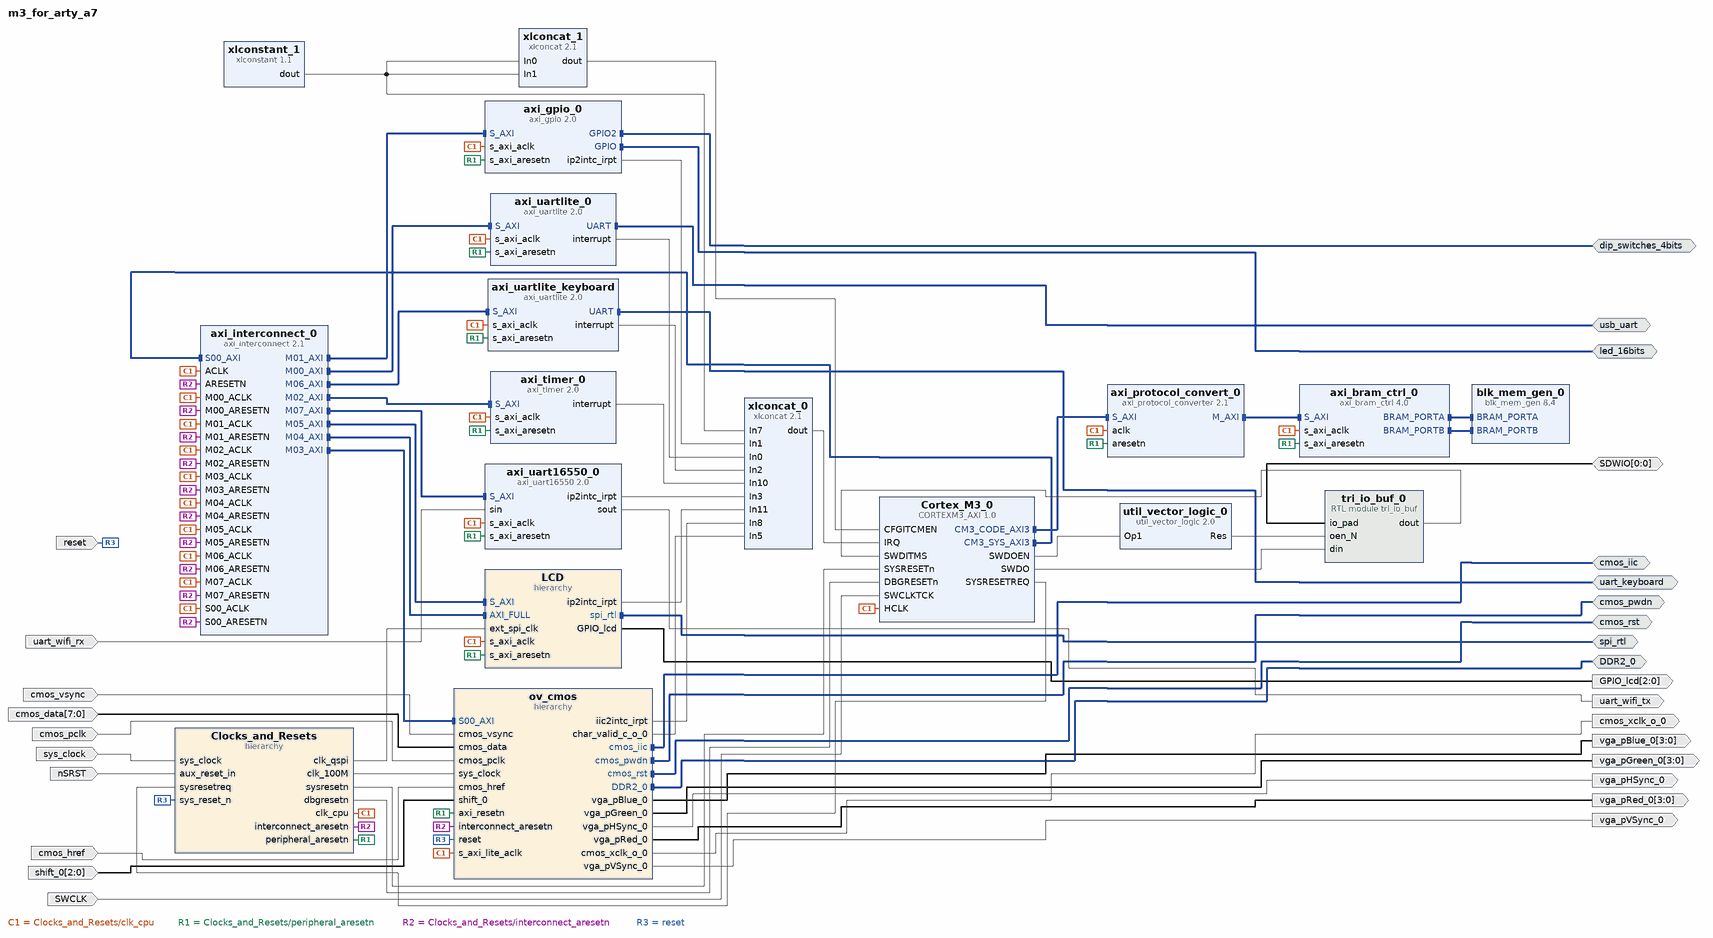
[diagram p0: block diagram of the top level]
# Vivado block design m3_for_arty_a7, xc7a100tcsg324-1, Vivado 2018.2
create_bd_design m3_for_arty_a7

create_bd_intf_port -mode Master -vlnv xilinx.com:interface:gpio_rtl:1.0 dip_switches_4bits
create_bd_intf_port -mode Master -vlnv xilinx.com:interface:uart_rtl:1.0 usb_uart
create_bd_intf_port -mode Master -vlnv xilinx.com:interface:iic_rtl:1.0 cmos_iic
create_bd_intf_port -mode Master -vlnv xilinx.com:interface:gpio_rtl:1.0 cmos_pwdn
create_bd_intf_port -mode Master -vlnv xilinx.com:interface:gpio_rtl:1.0 cmos_rst
create_bd_intf_port -mode Master -vlnv xilinx.com:interface:ddrx_rtl:1.0 DDR2_0
create_bd_intf_port -mode Master -vlnv xilinx.com:interface:spi_rtl:1.0 spi_rtl
create_bd_intf_port -mode Master -vlnv xilinx.com:interface:uart_rtl:1.0 uart_keyboard
create_bd_intf_port -mode Master -vlnv xilinx.com:interface:gpio_rtl:1.0 led_16bits
create_bd_port -dir I -type clk sys_clock
set_property -dict {CONFIG.FREQ_HZ 100000000 CONFIG.PHASE 0.000} [get_bd_ports sys_clock]
create_bd_port -dir I -type rst reset
set_property -dict {CONFIG.POLARITY ACTIVE_LOW} [get_bd_ports reset]
create_bd_port -dir I cmos_vsync
create_bd_port -dir I -from 7 -to 0 cmos_data
create_bd_port -dir I cmos_pclk
create_bd_port -dir I cmos_href
create_bd_port -dir O -from 3 -to 0 vga_pBlue_0
create_bd_port -dir O -from 3 -to 0 vga_pGreen_0
create_bd_port -dir O vga_pHSync_0
create_bd_port -dir O -from 3 -to 0 vga_pRed_0
create_bd_port -dir O vga_pVSync_0
create_bd_port -dir O cmos_xclk_o_0
create_bd_port -dir I -type clk SWCLK
create_bd_port -dir IO -from 0 -to 0 SDWIO
create_bd_port -dir I -type rst nSRST
create_bd_port -dir O -from 2 -to 0 GPIO_lcd
create_bd_port -dir O uart_wifi_tx
create_bd_port -dir I uart_wifi_rx
create_bd_port -dir I -from 2 -to 0 shift_0

create_bd_cell -type hier Clocks_and_Resets
create_bd_cell -type ip -vlnv Arm.com:CortexM:CORTEXM3_AXI:1.0 Cortex_M3_0
set_property -dict [list \
  CONFIG.JTAG_PRESENT false \
  CONFIG.ITCM_SIZE {"1000"} \
  CONFIG.DTCM_SIZE {"0110"} \
  CONFIG.ITCM_INIT_FILE bram_a7.hex \
  CONFIG.TRACE_LVL 1 \
  CONFIG.DEBUG_LVL 2 \
  CONFIG.WIC_PRESENT false \
] [get_bd_cells Cortex_M3_0]
create_bd_cell -type ip -vlnv xilinx.com:ip:axi_gpio:2.0 axi_gpio_0
set_property -dict [list \
  CONFIG.C_GPIO_WIDTH 16 \
  CONFIG.C_GPIO2_WIDTH 4 \
  CONFIG.C_IS_DUAL 1 \
  CONFIG.C_ALL_INPUTS_2 1 \
  CONFIG.C_INTERRUPT_PRESENT 1 \
  CONFIG.USE_BOARD_FLOW true \
  CONFIG.GPIO_BOARD_INTERFACE Custom \
  CONFIG.GPIO2_BOARD_INTERFACE Custom \
  CONFIG.C_ALL_OUTPUTS 1 \
] [get_bd_cells axi_gpio_0]
create_bd_cell -type ip -vlnv xilinx.com:ip:axi_interconnect:2.1 axi_interconnect_0
set_property -dict [list \
  CONFIG.NUM_SI 1 \
  CONFIG.NUM_MI 8 \
  CONFIG.ENABLE_ADVANCED_OPTIONS 1 \
  CONFIG.SYNCHRONIZATION_STAGES 2 \
  CONFIG.M00_HAS_REGSLICE 0 \
  CONFIG.M01_HAS_REGSLICE 3 \
  CONFIG.M02_HAS_REGSLICE 3 \
  CONFIG.M03_HAS_REGSLICE 3 \
  CONFIG.M04_HAS_REGSLICE 3 \
  CONFIG.M05_HAS_REGSLICE 3 \
  CONFIG.M00_HAS_DATA_FIFO 0 \
  CONFIG.M01_HAS_DATA_FIFO 0 \
  CONFIG.S00_HAS_REGSLICE 3 \
  CONFIG.S01_HAS_REGSLICE 3 \
  CONFIG.S01_HAS_DATA_FIFO 1 \
  CONFIG.M00_SECURE 0 \
  CONFIG.M01_SECURE 0 \
  CONFIG.M02_SECURE 0 \
] [get_bd_cells axi_interconnect_0]
create_bd_cell -type ip -vlnv xilinx.com:ip:xlconcat:2.1 xlconcat_0
set_property -dict {CONFIG.NUM_PORTS 12 CONFIG.dout_width 12} [get_bd_cells xlconcat_0]
create_bd_cell -type ip -vlnv xilinx.com:ip:xlconcat:2.1 xlconcat_1
set_property -dict {CONFIG.NUM_PORTS 2 CONFIG.IN6_WIDTH 25} [get_bd_cells xlconcat_1]
create_bd_cell -type ip -vlnv xilinx.com:ip:xlconstant:1.1 xlconstant_1
set_property -dict {CONFIG.CONST_WIDTH 1 CONFIG.CONST_VAL 1} [get_bd_cells xlconstant_1]
create_bd_cell -type ip -vlnv xilinx.com:ip:axi_timer:2.0 axi_timer_0
create_bd_cell -type hier ov_cmos
create_bd_cell -type ip -vlnv xilinx.com:ip:axi_uartlite:2.0 axi_uartlite_0
set_property -dict [list \
  CONFIG.C_BAUDRATE 115200 \
  CONFIG.C_S_AXI_ACLK_FREQ_HZ 50000000 \
  CONFIG.USE_BOARD_FLOW true \
  CONFIG.UARTLITE_BOARD_INTERFACE Custom \
] [get_bd_cells axi_uartlite_0]
create_bd_cell -type ip -vlnv xilinx.com:ip:blk_mem_gen:8.4 blk_mem_gen_0
set_property -dict [list \
  CONFIG.Memory_Type Dual_Port_ROM \
  CONFIG.Assume_Synchronous_Clk true \
  CONFIG.Enable_B Use_ENB_Pin \
  CONFIG.Use_RSTB_Pin true \
  CONFIG.Port_A_Write_Rate 0 \
  CONFIG.Port_B_Clock 100 \
  CONFIG.Port_B_Write_Rate 0 \
  CONFIG.Port_B_Enable_Rate 100 \
] [get_bd_cells blk_mem_gen_0]
create_bd_cell -type ip -vlnv xilinx.com:ip:axi_bram_ctrl:4.0 axi_bram_ctrl_0
create_bd_cell -type ip -vlnv xilinx.com:ip:axi_protocol_converter:2.1 axi_protocol_convert_0
create_bd_cell -type ip -vlnv xilinx.com:ip:util_vector_logic:2.0 util_vector_logic_0
set_property -dict {CONFIG.C_SIZE 1 CONFIG.C_OPERATION not} [get_bd_cells util_vector_logic_0]
create_bd_cell -type hier LCD
create_bd_cell -type ip -vlnv xilinx.com:ip:axi_uartlite:2.0 axi_uartlite_keyboard
create_bd_cell -type ip -vlnv xilinx.com:ip:axi_uart16550:2.0 axi_uart16550_0
create_bd_cell -type module -reference tri_io_buf tri_io_buf_0

# ---- hierarchy /Clocks_and_Resets ----
current_bd_instance /Clocks_and_Resets
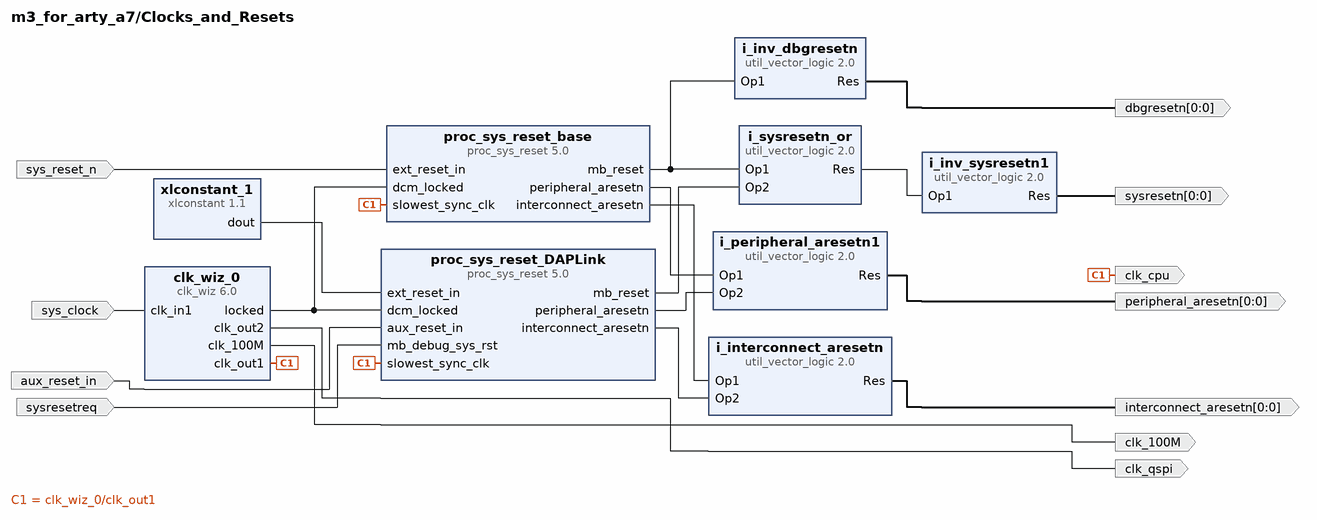
[diagram p1: block diagram inside /Clocks_and_Resets]
create_bd_pin -dir I -type rst aux_reset_in
create_bd_pin -dir O -from 0 -to 0 -type rst interconnect_aresetn
create_bd_pin -dir O -from 0 -to 0 -type rst peripheral_aresetn
create_bd_pin -dir O -type clk clk_cpu
create_bd_pin -dir I -type clk sys_clock
create_bd_pin -dir O -from 0 -to 0 sysresetn
create_bd_pin -dir O -from 0 -to 0 dbgresetn
create_bd_pin -dir O clk_qspi
create_bd_pin -dir I sysresetreq
create_bd_pin -dir I -type rst sys_reset_n
create_bd_pin -dir O -type clk clk_100M

create_bd_cell -type ip -vlnv xilinx.com:ip:clk_wiz:6.0 clk_wiz_0
set_property -dict [list \
  CONFIG.USE_INCLK_SWITCHOVER false \
  CONFIG.SECONDARY_SOURCE Single_ended_clock_capable_pin \
  CONFIG.CLKIN1_JITTER_PS 833.33 \
  CONFIG.CLKIN2_JITTER_PS 833.33 \
  CONFIG.CLKOUT2_USED true \
  CONFIG.CLKOUT3_USED true \
  CONFIG.NUM_OUT_CLKS 3 \
  CONFIG.CLK_OUT3_PORT clk_100M \
  CONFIG.CLKOUT1_REQUESTED_OUT_FREQ 50.0 \
  CONFIG.CLKOUT2_REQUESTED_OUT_FREQ 50.0 \
  CONFIG.CLKOUT3_REQUESTED_OUT_FREQ 100.000 \
  CONFIG.CLKOUT1_DRIVES BUFGCE \
  CONFIG.CLKOUT2_DRIVES BUFGCE \
  CONFIG.CLKOUT3_DRIVES BUFGCE \
  CONFIG.CLKOUT4_DRIVES BUFGCE \
  CONFIG.CLKOUT5_DRIVES BUFGCE \
  CONFIG.CLKOUT6_DRIVES BUFGCE \
  CONFIG.CLKOUT7_DRIVES BUFGCE \
  CONFIG.FEEDBACK_SOURCE FDBK_AUTO \
  CONFIG.USE_RESET false \
  CONFIG.MMCM_DIVCLK_DIVIDE 1 \
  CONFIG.MMCM_CLKFBOUT_MULT_F 10.000 \
  CONFIG.MMCM_CLKIN1_PERIOD 10.000 \
  CONFIG.MMCM_CLKIN2_PERIOD 10.000 \
  CONFIG.MMCM_CLKOUT0_DIVIDE_F 20.000 \
  CONFIG.MMCM_CLKOUT1_DIVIDE 20 \
  CONFIG.MMCM_CLKOUT2_DIVIDE 10 \
  CONFIG.USE_SAFE_CLOCK_STARTUP true \
  CONFIG.USE_BOARD_FLOW true \
  CONFIG.CLK_IN1_BOARD_INTERFACE sys_clock \
  CONFIG.CLK_IN2_BOARD_INTERFACE Custom \
  CONFIG.RESET_BOARD_INTERFACE Custom \
  CONFIG.CLKOUT1_JITTER 151.636 \
  CONFIG.CLKOUT1_PHASE_ERROR 98.575 \
  CONFIG.CLKOUT2_JITTER 151.636 \
  CONFIG.CLKOUT2_PHASE_ERROR 98.575 \
  CONFIG.CLKOUT3_JITTER 130.958 \
  CONFIG.CLKOUT3_PHASE_ERROR 98.575 \
] [get_bd_cells clk_wiz_0]
create_bd_cell -type ip -vlnv xilinx.com:ip:util_vector_logic:2.0 i_interconnect_aresetn
set_property -dict {CONFIG.C_SIZE 1} [get_bd_cells i_interconnect_aresetn]
create_bd_cell -type ip -vlnv xilinx.com:ip:util_vector_logic:2.0 i_inv_dbgresetn
set_property -dict {CONFIG.C_SIZE 1 CONFIG.C_OPERATION not} [get_bd_cells i_inv_dbgresetn]
create_bd_cell -type ip -vlnv xilinx.com:ip:util_vector_logic:2.0 i_inv_sysresetn1
set_property -dict {CONFIG.C_SIZE 1 CONFIG.C_OPERATION not} [get_bd_cells i_inv_sysresetn1]
create_bd_cell -type ip -vlnv xilinx.com:ip:util_vector_logic:2.0 i_peripheral_aresetn1
set_property -dict {CONFIG.C_SIZE 1} [get_bd_cells i_peripheral_aresetn1]
create_bd_cell -type ip -vlnv xilinx.com:ip:util_vector_logic:2.0 i_sysresetn_or
set_property -dict {CONFIG.C_SIZE 1 CONFIG.C_OPERATION or} [get_bd_cells i_sysresetn_or]
create_bd_cell -type ip -vlnv xilinx.com:ip:proc_sys_reset:5.0 proc_sys_reset_DAPLink
set_property -dict [list \
  CONFIG.C_AUX_RST_WIDTH 1 \
  CONFIG.C_EXT_RST_WIDTH 1 \
  CONFIG.USE_BOARD_FLOW true \
  CONFIG.RESET_BOARD_INTERFACE Custom \
] [get_bd_cells proc_sys_reset_DAPLink]
create_bd_cell -type ip -vlnv xilinx.com:ip:proc_sys_reset:5.0 proc_sys_reset_base
set_property -dict [list \
  CONFIG.C_EXT_RESET_HIGH 0 \
  CONFIG.C_AUX_RST_WIDTH 1 \
  CONFIG.C_EXT_RST_WIDTH 1 \
  CONFIG.USE_BOARD_FLOW true \
  CONFIG.RESET_BOARD_INTERFACE reset \
] [get_bd_cells proc_sys_reset_base]
create_bd_cell -type ip -vlnv xilinx.com:ip:xlconstant:1.1 xlconstant_1

# ---- hierarchy /ov_cmos ----
current_bd_instance /ov_cmos
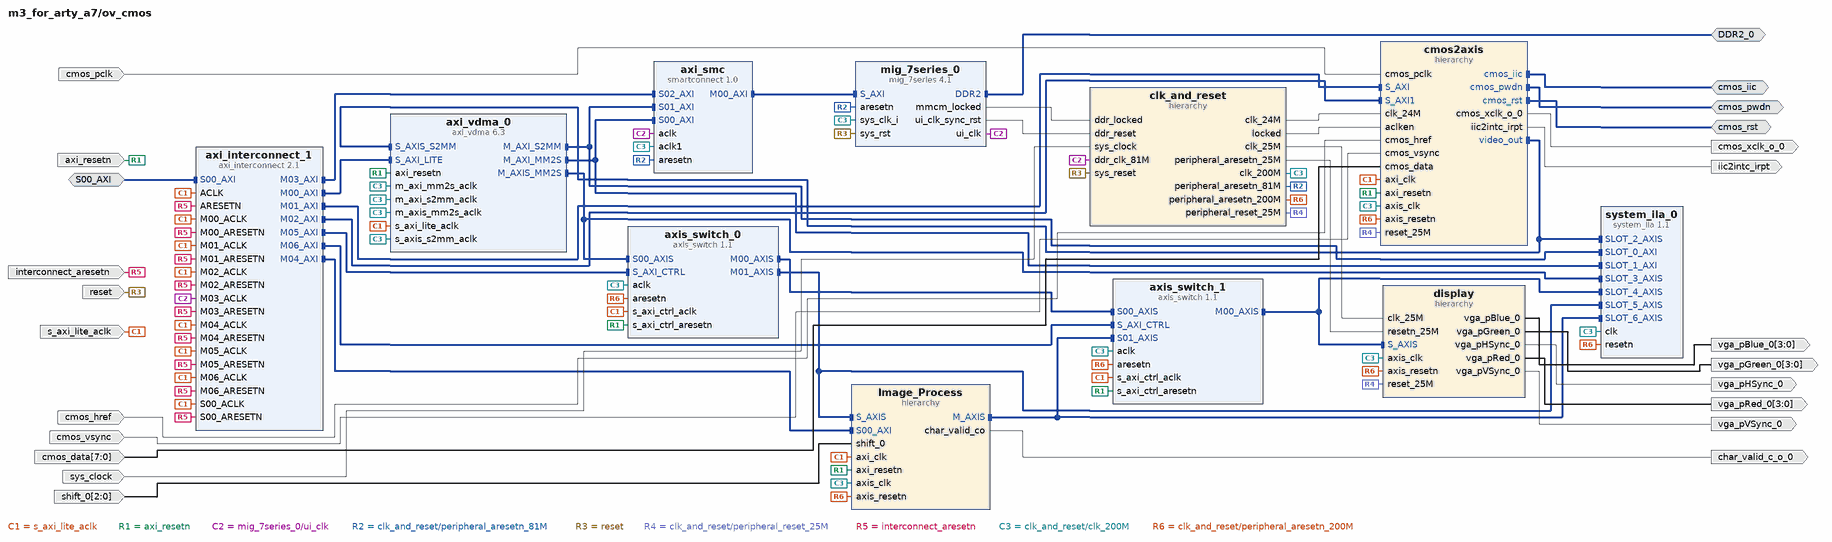
[diagram p2: block diagram inside /ov_cmos]
create_bd_intf_pin -mode Master -vlnv xilinx.com:interface:ddrx_rtl:1.0 DDR2_0
create_bd_intf_pin -mode Master -vlnv xilinx.com:interface:iic_rtl:1.0 cmos_iic
create_bd_intf_pin -mode Master -vlnv xilinx.com:interface:gpio_rtl:1.0 cmos_rst
create_bd_intf_pin -mode Master -vlnv xilinx.com:interface:gpio_rtl:1.0 cmos_pwdn
create_bd_intf_pin -mode Slave -vlnv xilinx.com:interface:aximm_rtl:1.0 S00_AXI
create_bd_pin -dir I cmos_vsync
create_bd_pin -dir I -from 7 -to 0 cmos_data
create_bd_pin -dir I cmos_pclk
create_bd_pin -dir I cmos_href
create_bd_pin -dir I -type clk s_axi_lite_aclk
create_bd_pin -dir I -type rst axi_resetn
create_bd_pin -dir I -type rst reset
create_bd_pin -dir I -type clk sys_clock
create_bd_pin -dir O -from 3 -to 0 vga_pBlue_0
create_bd_pin -dir O -from 3 -to 0 vga_pGreen_0
create_bd_pin -dir O vga_pHSync_0
create_bd_pin -dir O -from 3 -to 0 vga_pRed_0
create_bd_pin -dir O vga_pVSync_0
create_bd_pin -dir O -type intr iic2intc_irpt
create_bd_pin -dir O cmos_xclk_o_0
create_bd_pin -dir I -type rst interconnect_aresetn
create_bd_pin -dir O char_valid_c_o_0
create_bd_pin -dir I -from 2 -to 0 shift_0

create_bd_cell -type ip -vlnv xilinx.com:ip:axi_vdma:6.3 axi_vdma_0
set_property -dict {CONFIG.c_m_axis_mm2s_tdata_width 24} [get_bd_cells axi_vdma_0]
create_bd_cell -type ip -vlnv xilinx.com:ip:mig_7series:4.1 mig_7series_0
set_property -dict {CONFIG.RESET_BOARD_INTERFACE reset} [get_bd_cells mig_7series_0]
create_bd_cell -type ip -vlnv xilinx.com:ip:smartconnect:1.0 axi_smc
set_property -dict {CONFIG.NUM_SI 3 CONFIG.NUM_CLKS 2} [get_bd_cells axi_smc]
create_bd_cell -type hier Image_Process
create_bd_cell -type ip -vlnv xilinx.com:ip:axi_interconnect:2.1 axi_interconnect_1
set_property -dict [list \
  CONFIG.NUM_SI 1 \
  CONFIG.NUM_MI 7 \
  CONFIG.ENABLE_ADVANCED_OPTIONS 1 \
  CONFIG.SYNCHRONIZATION_STAGES 2 \
  CONFIG.M00_HAS_REGSLICE 0 \
  CONFIG.M01_HAS_REGSLICE 3 \
  CONFIG.M02_HAS_REGSLICE 3 \
  CONFIG.M03_HAS_REGSLICE 3 \
  CONFIG.M04_HAS_REGSLICE 3 \
  CONFIG.M05_HAS_REGSLICE 3 \
  CONFIG.M00_HAS_DATA_FIFO 0 \
  CONFIG.M01_HAS_DATA_FIFO 0 \
  CONFIG.S00_HAS_REGSLICE 3 \
  CONFIG.S01_HAS_REGSLICE 3 \
  CONFIG.S01_HAS_DATA_FIFO 1 \
  CONFIG.M00_SECURE 0 \
  CONFIG.M01_SECURE 0 \
  CONFIG.M02_SECURE 0 \
] [get_bd_cells axi_interconnect_1]
create_bd_cell -type hier cmos2axis
create_bd_cell -type hier display
create_bd_cell -type hier clk_and_reset
create_bd_cell -type ip -vlnv xilinx.com:ip:axis_switch:1.1 axis_switch_1
set_property -dict {CONFIG.ROUTING_MODE 1} [get_bd_cells axis_switch_1]
create_bd_cell -type ip -vlnv xilinx.com:ip:axis_switch:1.1 axis_switch_0
set_property -dict {CONFIG.NUM_SI 1 CONFIG.NUM_MI 2 CONFIG.ROUTING_MODE 1 CONFIG.DECODER_REG 1} [get_bd_cells axis_switch_0]
create_bd_cell -type ip -vlnv xilinx.com:ip:system_ila:1.1 system_ila_0
set_property -dict [list \
  CONFIG.C_SLOT_0_APC_EN 0 \
  CONFIG.C_SLOT_1_APC_EN 0 \
  CONFIG.C_SLOT_2_APC_EN 0 \
  CONFIG.C_SLOT_3_APC_EN 0 \
  CONFIG.C_SLOT_4_APC_EN 0 \
  CONFIG.C_SLOT_5_APC_EN 0 \
  CONFIG.C_SLOT_6_APC_EN 0 \
  CONFIG.C_SLOT_0_AXI_AW_SEL_DATA 1 \
  CONFIG.C_SLOT_0_AXI_W_SEL_DATA 1 \
  CONFIG.C_SLOT_0_AXI_B_SEL_DATA 1 \
  CONFIG.C_SLOT_0_AXI_AR_SEL_DATA 1 \
  CONFIG.C_SLOT_0_AXI_R_SEL_DATA 1 \
  CONFIG.C_SLOT_1_AXI_AW_SEL_DATA 1 \
  CONFIG.C_SLOT_1_AXI_W_SEL_DATA 1 \
  CONFIG.C_SLOT_1_AXI_B_SEL_DATA 1 \
  CONFIG.C_SLOT_1_AXI_AR_SEL_DATA 1 \
  CONFIG.C_SLOT_1_AXI_R_SEL_DATA 1 \
  CONFIG.C_SLOT_0_AXI_AW_SEL_TRIG 1 \
  CONFIG.C_SLOT_0_AXI_W_SEL_TRIG 1 \
  CONFIG.C_SLOT_0_AXI_B_SEL_TRIG 1 \
  CONFIG.C_SLOT_0_AXI_AR_SEL_TRIG 1 \
  CONFIG.C_SLOT_0_AXI_R_SEL_TRIG 1 \
  CONFIG.C_SLOT_1_AXI_AW_SEL_TRIG 1 \
  CONFIG.C_SLOT_1_AXI_W_SEL_TRIG 1 \
  CONFIG.C_SLOT_1_AXI_B_SEL_TRIG 1 \
  CONFIG.C_SLOT_1_AXI_AR_SEL_TRIG 1 \
  CONFIG.C_SLOT_1_AXI_R_SEL_TRIG 1 \
  CONFIG.C_SLOT_2_AXI_DATA_SEL 1 \
  CONFIG.C_SLOT_3_AXI_DATA_SEL 1 \
  CONFIG.C_SLOT_4_AXI_DATA_SEL 1 \
  CONFIG.C_SLOT_5_AXI_DATA_SEL 1 \
  CONFIG.C_SLOT_6_AXI_DATA_SEL 1 \
  CONFIG.C_SLOT_2_AXI_TRIG_SEL 1 \
  CONFIG.C_SLOT_3_AXI_TRIG_SEL 1 \
  CONFIG.C_SLOT_4_AXI_TRIG_SEL 1 \
  CONFIG.C_SLOT_5_AXI_TRIG_SEL 1 \
  CONFIG.C_SLOT_6_AXI_TRIG_SEL 1 \
  CONFIG.C_NUM_MONITOR_SLOTS 7 \
  CONFIG.C_SLOT_0_INTF_TYPE xilinx.com:interface:aximm_rtl:1.0 \
  CONFIG.C_SLOT_1_INTF_TYPE xilinx.com:interface:aximm_rtl:1.0 \
  CONFIG.C_SLOT_2_INTF_TYPE xilinx.com:interface:axis_rtl:1.0 \
  CONFIG.C_SLOT_3_INTF_TYPE xilinx.com:interface:axis_rtl:1.0 \
  CONFIG.C_SLOT_4_INTF_TYPE xilinx.com:interface:axis_rtl:1.0 \
  CONFIG.C_SLOT_5_INTF_TYPE xilinx.com:interface:axis_rtl:1.0 \
  CONFIG.C_SLOT_6_INTF_TYPE xilinx.com:interface:axis_rtl:1.0 \
  CONFIG.C_MON_TYPE INTERFACE \
] [get_bd_cells system_ila_0]

# ---- hierarchy /ov_cmos/Image_Process ----
current_bd_instance /ov_cmos/Image_Process
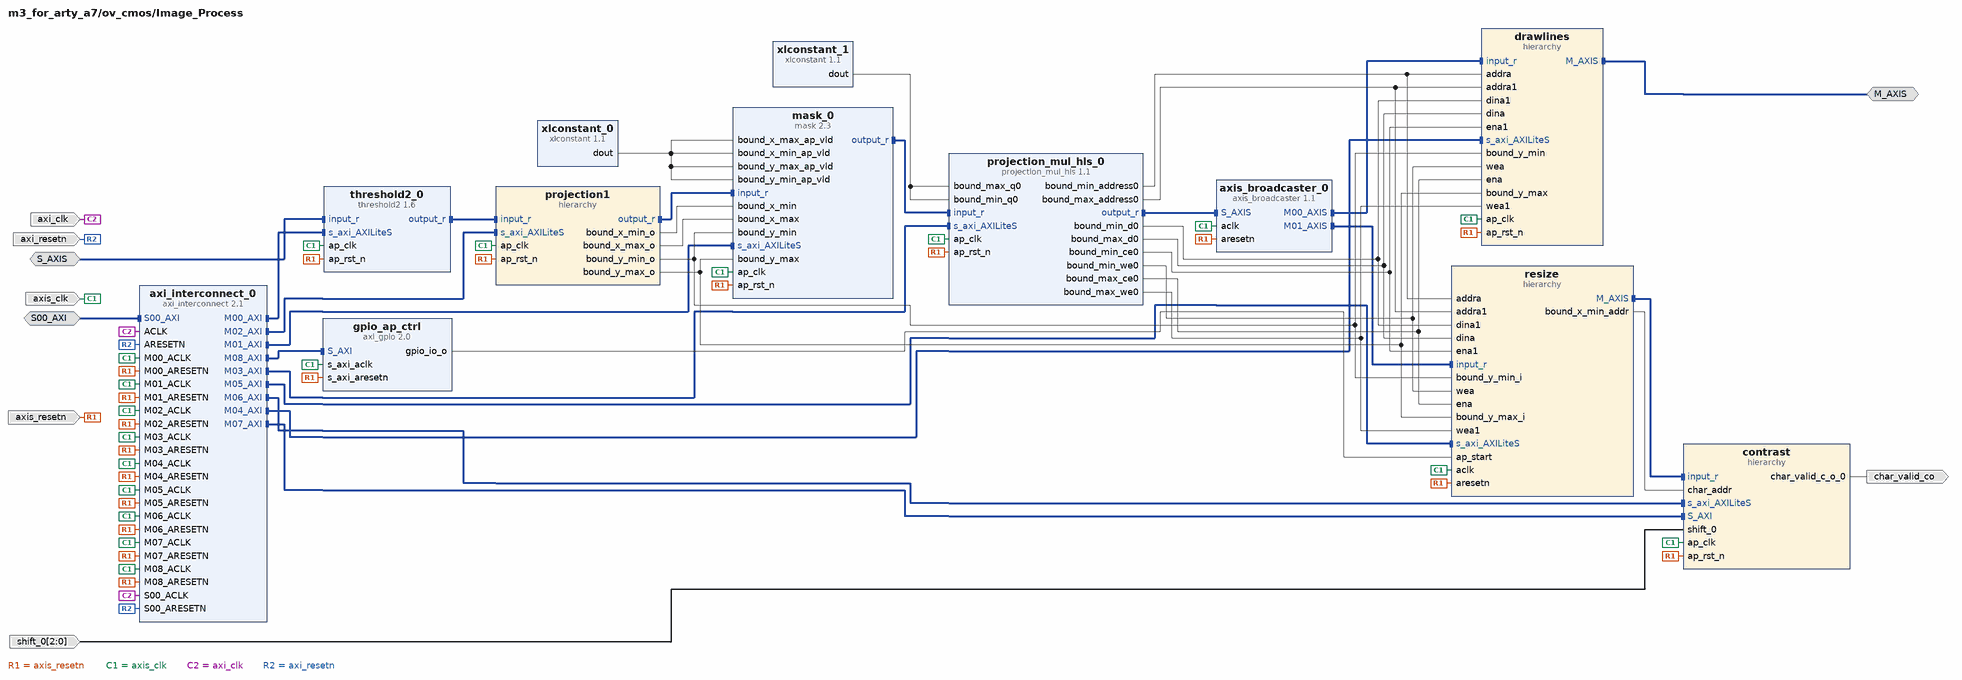
[diagram p3: block diagram inside /ov_cmos/Image_Process]
create_bd_intf_pin -mode Slave -vlnv xilinx.com:interface:aximm_rtl:1.0 S00_AXI
create_bd_intf_pin -mode Slave -vlnv xilinx.com:interface:axis_rtl:1.0 S_AXIS
create_bd_intf_pin -mode Master -vlnv xilinx.com:interface:axis_rtl:1.0 M_AXIS
create_bd_pin -dir I -type clk axi_clk
create_bd_pin -dir I -type rst axi_resetn
create_bd_pin -dir I -type clk axis_clk
create_bd_pin -dir I -type rst axis_resetn
create_bd_pin -dir O char_valid_co
create_bd_pin -dir I -from 2 -to 0 shift_0

create_bd_cell -type ip -vlnv xilinx.com:ip:axi_interconnect:2.1 axi_interconnect_0
set_property -dict {CONFIG.NUM_MI 9} [get_bd_cells axi_interconnect_0]
create_bd_cell -type ip -vlnv xilinx.com:ip:xlconstant:1.1 xlconstant_0
create_bd_cell -type ip -vlnv xilinx.com:ip:axis_broadcaster:1.1 axis_broadcaster_0
create_bd_cell -type ip -vlnv xilinx.com:ip:xlconstant:1.1 xlconstant_1
set_property -dict {CONFIG.CONST_WIDTH 16 CONFIG.CONST_VAL 0} [get_bd_cells xlconstant_1]
create_bd_cell -type hier contrast
create_bd_cell -type hier resize
create_bd_cell -type hier projection1
create_bd_cell -type hier drawlines
create_bd_cell -type ip -vlnv starrynightzyq.com:hls:mask:2.3 mask_0
create_bd_cell -type ip -vlnv starrynightzyq.com:hls:threshold2:1.6 threshold2_0
create_bd_cell -type ip -vlnv starrynightzyq.com:hls:projection_mul_hls:1.1 projection_mul_hls_0
create_bd_cell -type ip -vlnv xilinx.com:ip:axi_gpio:2.0 gpio_ap_ctrl
set_property -dict {CONFIG.C_GPIO_WIDTH 1 CONFIG.C_ALL_OUTPUTS 1} [get_bd_cells gpio_ap_ctrl]

# ---- hierarchy /ov_cmos/Image_Process/contrast ----
current_bd_instance /ov_cmos/Image_Process/contrast
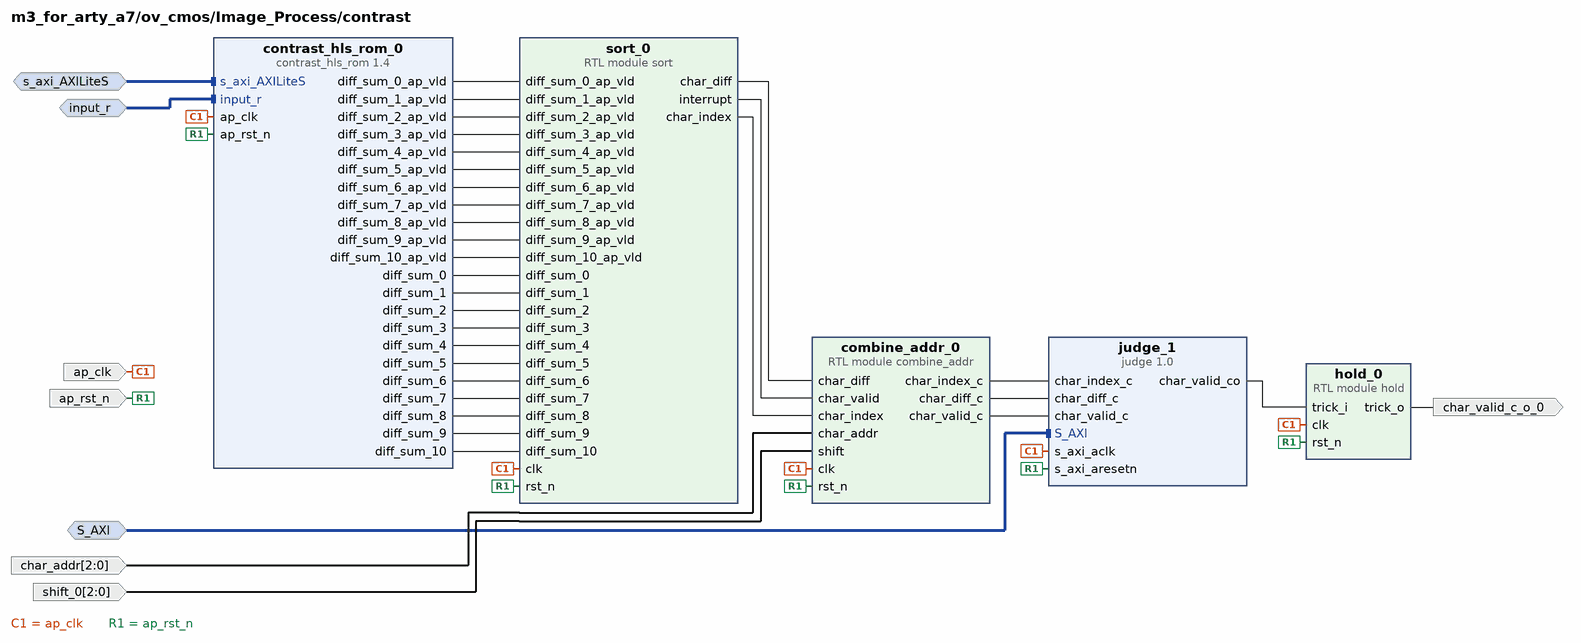
[diagram p4: block diagram inside /ov_cmos/Image_Process/contrast]
create_bd_intf_pin -mode Slave -vlnv xilinx.com:interface:aximm_rtl:1.0 s_axi_AXILiteS
create_bd_intf_pin -mode Slave -vlnv xilinx.com:interface:axis_rtl:1.0 input_r
create_bd_intf_pin -mode Slave -vlnv xilinx.com:interface:aximm_rtl:1.0 S_AXI
create_bd_pin -dir I -type clk ap_clk
create_bd_pin -dir I -type rst ap_rst_n
create_bd_pin -dir I -from 2 -to 0 char_addr
create_bd_pin -dir O char_valid_c_o_0
create_bd_pin -dir I -from 2 -to 0 shift_0

create_bd_cell -type module -reference sort sort_0
create_bd_cell -type module -reference hold hold_0
create_bd_cell -type ip -vlnv starrynightzyq.com:hls:contrast_hls_rom:1.4 contrast_hls_rom_0
create_bd_cell -type ip -vlnv starrynightzyq.com:user:judge:1.0 judge_1
create_bd_cell -type module -reference combine_addr combine_addr_0

# ---- hierarchy /ov_cmos/Image_Process/resize ----
current_bd_instance /ov_cmos/Image_Process/resize
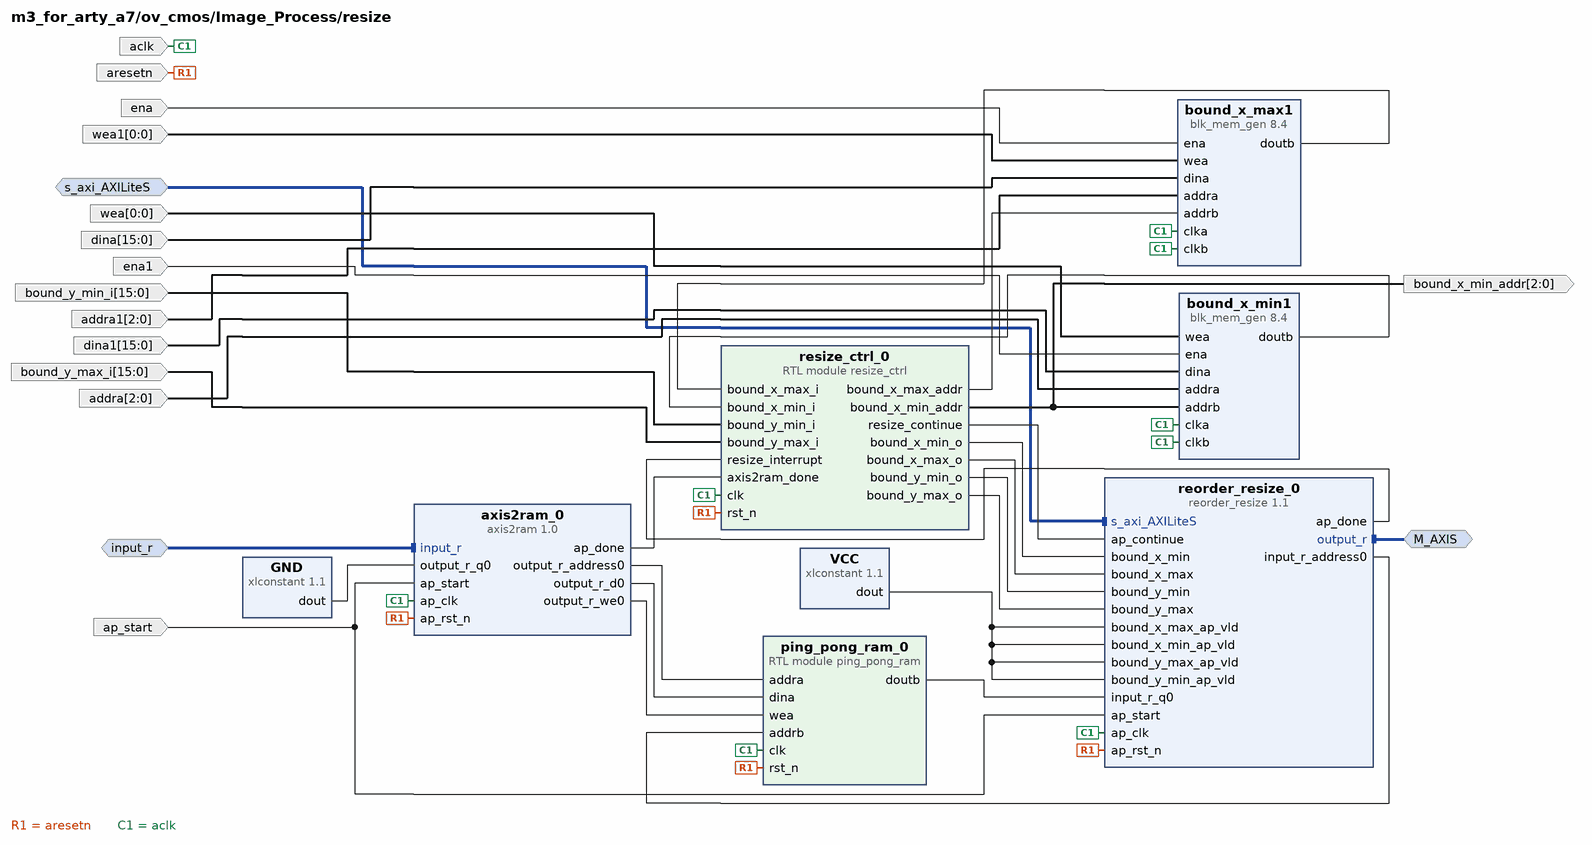
[diagram p5: block diagram inside /ov_cmos/Image_Process/resize]
create_bd_intf_pin -mode Slave -vlnv xilinx.com:interface:axis_rtl:1.0 input_r
create_bd_intf_pin -mode Master -vlnv xilinx.com:interface:axis_rtl:1.0 M_AXIS
create_bd_intf_pin -mode Slave -vlnv xilinx.com:interface:aximm_rtl:1.0 s_axi_AXILiteS
create_bd_pin -dir I -type rst aresetn
create_bd_pin -dir I -type clk aclk
create_bd_pin -dir O -from 2 -to 0 bound_x_min_addr
create_bd_pin -dir I -from 15 -to 0 bound_y_min_i
create_bd_pin -dir I -from 15 -to 0 bound_y_max_i
create_bd_pin -dir I ena
create_bd_pin -dir I -from 0 -to 0 wea
create_bd_pin -dir I ena1
create_bd_pin -dir I -from 0 -to 0 wea1
create_bd_pin -dir I -from 15 -to 0 dina
create_bd_pin -dir I -from 15 -to 0 dina1
create_bd_pin -dir I -from 2 -to 0 addra
create_bd_pin -dir I -from 2 -to 0 addra1
create_bd_pin -dir I ap_start

create_bd_cell -type ip -vlnv xilinx.com:ip:xlconstant:1.1 VCC
create_bd_cell -type ip -vlnv xilinx.com:ip:blk_mem_gen:8.4 bound_x_max1
set_property -dict [list \
  CONFIG.Memory_Type Simple_Dual_Port_RAM \
  CONFIG.Enable_32bit_Address false \
  CONFIG.Use_Byte_Write_Enable false \
  CONFIG.Assume_Synchronous_Clk true \
  CONFIG.Write_Width_A 16 \
  CONFIG.Write_Depth_A 8 \
  CONFIG.Operating_Mode_A NO_CHANGE \
  CONFIG.Write_Width_B 16 \
  CONFIG.Read_Width_B 16 \
  CONFIG.Enable_B Always_Enabled \
  CONFIG.Register_PortB_Output_of_Memory_Primitives true \
  CONFIG.Port_B_Clock 100 \
  CONFIG.Port_B_Enable_Rate 100 \
  CONFIG.use_bram_block Stand_Alone \
] [get_bd_cells bound_x_max1]
create_bd_cell -type ip -vlnv xilinx.com:ip:blk_mem_gen:8.4 bound_x_min1
set_property -dict [list \
  CONFIG.Memory_Type Simple_Dual_Port_RAM \
  CONFIG.Enable_32bit_Address false \
  CONFIG.Use_Byte_Write_Enable false \
  CONFIG.Assume_Synchronous_Clk true \
  CONFIG.Write_Width_A 16 \
  CONFIG.Write_Depth_A 8 \
  CONFIG.Operating_Mode_A NO_CHANGE \
  CONFIG.Write_Width_B 16 \
  CONFIG.Read_Width_B 16 \
  CONFIG.Enable_B Always_Enabled \
  CONFIG.Register_PortB_Output_of_Memory_Primitives true \
  CONFIG.Port_B_Clock 100 \
  CONFIG.Port_B_Enable_Rate 100 \
  CONFIG.use_bram_block Stand_Alone \
] [get_bd_cells bound_x_min1]
create_bd_cell -type ip -vlnv reorder_resize:hls:reorder_resize:1.1 reorder_resize_0
create_bd_cell -type ip -vlnv axis2ram:hls:axis2ram:1.0 axis2ram_0
create_bd_cell -type module -reference resize_ctrl resize_ctrl_0
create_bd_cell -type module -reference ping_pong_ram ping_pong_ram_0
create_bd_cell -type ip -vlnv xilinx.com:ip:xlconstant:1.1 GND
set_property -dict {CONFIG.CONST_VAL 0} [get_bd_cells GND]

# ---- hierarchy /ov_cmos/Image_Process/projection1 ----
current_bd_instance /ov_cmos/Image_Process/projection1
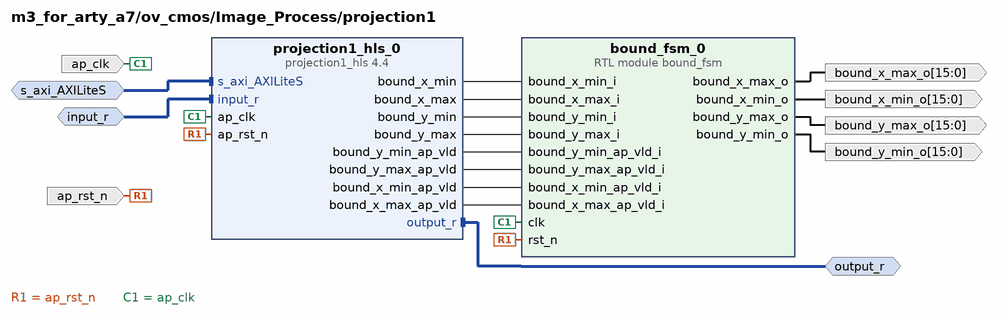
[diagram p6: block diagram inside /ov_cmos/Image_Process/projection1]
create_bd_intf_pin -mode Slave -vlnv xilinx.com:interface:aximm_rtl:1.0 s_axi_AXILiteS
create_bd_intf_pin -mode Master -vlnv xilinx.com:interface:axis_rtl:1.0 output_r
create_bd_intf_pin -mode Slave -vlnv xilinx.com:interface:axis_rtl:1.0 input_r
create_bd_pin -dir I -type rst ap_rst_n
create_bd_pin -dir I -type clk ap_clk
create_bd_pin -dir O -from 15 -to 0 bound_x_min_o
create_bd_pin -dir O -from 15 -to 0 bound_x_max_o
create_bd_pin -dir O -from 15 -to 0 bound_y_max_o
create_bd_pin -dir O -from 15 -to 0 bound_y_min_o

create_bd_cell -type module -reference bound_fsm bound_fsm_0
create_bd_cell -type ip -vlnv starrynightzyq.com:hls:projection1_hls:4.4 projection1_hls_0

# ---- hierarchy /ov_cmos/Image_Process/drawlines ----
current_bd_instance /ov_cmos/Image_Process/drawlines
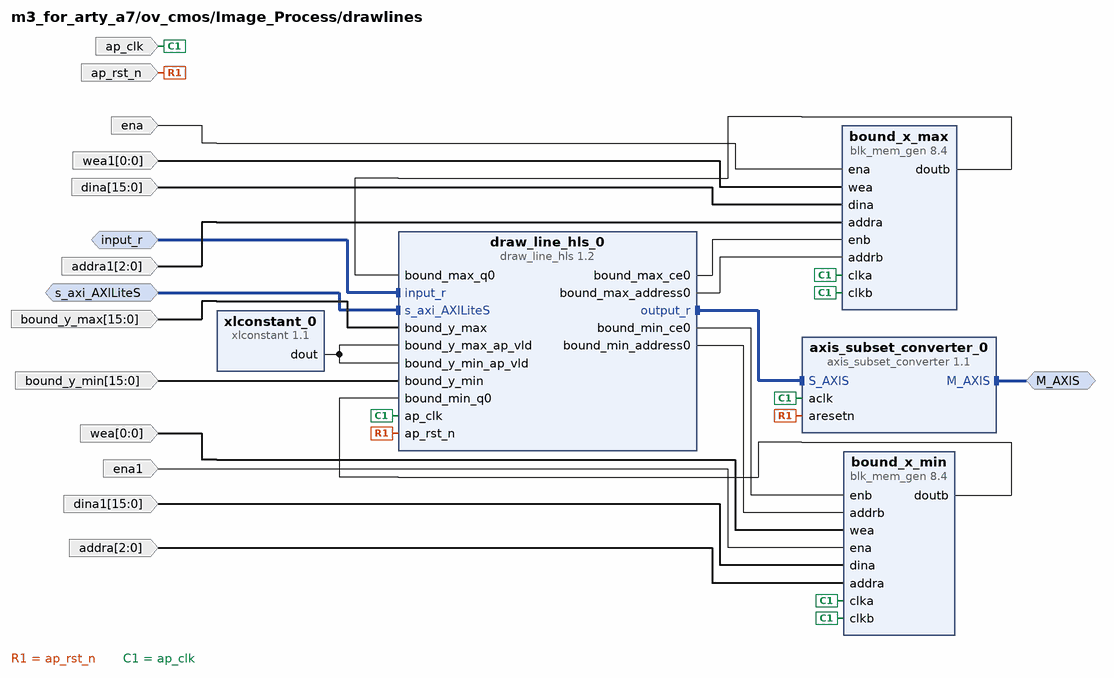
[diagram p7: block diagram inside /ov_cmos/Image_Process/drawlines]
create_bd_intf_pin -mode Slave -vlnv xilinx.com:interface:axis_rtl:1.0 input_r
create_bd_intf_pin -mode Slave -vlnv xilinx.com:interface:aximm_rtl:1.0 s_axi_AXILiteS
create_bd_intf_pin -mode Master -vlnv xilinx.com:interface:axis_rtl:1.0 M_AXIS
create_bd_pin -dir I -type rst ap_rst_n
create_bd_pin -dir I -type clk ap_clk
create_bd_pin -dir I -from 15 -to 0 -type data bound_y_max
create_bd_pin -dir I -from 15 -to 0 -type data bound_y_min
create_bd_pin -dir I ena
create_bd_pin -dir I -from 0 -to 0 wea
create_bd_pin -dir I ena1
create_bd_pin -dir I -from 0 -to 0 wea1
create_bd_pin -dir I -from 15 -to 0 dina
create_bd_pin -dir I -from 15 -to 0 dina1
create_bd_pin -dir I -from 2 -to 0 addra
create_bd_pin -dir I -from 2 -to 0 addra1

create_bd_cell -type ip -vlnv xilinx.com:ip:blk_mem_gen:8.4 bound_x_min
set_property -dict [list \
  CONFIG.Memory_Type Simple_Dual_Port_RAM \
  CONFIG.Enable_32bit_Address false \
  CONFIG.Use_Byte_Write_Enable false \
  CONFIG.Assume_Synchronous_Clk true \
  CONFIG.Write_Width_A 16 \
  CONFIG.Write_Depth_A 8 \
  CONFIG.Operating_Mode_A NO_CHANGE \
  CONFIG.Write_Width_B 16 \
  CONFIG.Read_Width_B 16 \
  CONFIG.Enable_B Use_ENB_Pin \
  CONFIG.Register_PortB_Output_of_Memory_Primitives true \
  CONFIG.Port_B_Clock 100 \
  CONFIG.Port_B_Enable_Rate 100 \
  CONFIG.use_bram_block Stand_Alone \
] [get_bd_cells bound_x_min]
create_bd_cell -type ip -vlnv xilinx.com:ip:blk_mem_gen:8.4 bound_x_max
set_property -dict [list \
  CONFIG.Memory_Type Simple_Dual_Port_RAM \
  CONFIG.Enable_32bit_Address false \
  CONFIG.Use_Byte_Write_Enable false \
  CONFIG.Assume_Synchronous_Clk true \
  CONFIG.Write_Width_A 16 \
  CONFIG.Write_Depth_A 8 \
  CONFIG.Operating_Mode_A NO_CHANGE \
  CONFIG.Write_Width_B 16 \
  CONFIG.Read_Width_B 16 \
  CONFIG.Enable_B Use_ENB_Pin \
  CONFIG.Register_PortB_Output_of_Memory_Primitives true \
  CONFIG.Port_B_Clock 100 \
  CONFIG.Port_B_Enable_Rate 100 \
  CONFIG.use_bram_block Stand_Alone \
] [get_bd_cells bound_x_max]
create_bd_cell -type ip -vlnv xilinx.com:ip:xlconstant:1.1 xlconstant_0
create_bd_cell -type ip -vlnv xilinx.com:ip:axis_subset_converter:1.1 axis_subset_converter_0
set_property -dict [list \
  CONFIG.M_TDATA_NUM_BYTES 3 \
  CONFIG.TDATA_REMAP {tdata[7:0],tdata[7:0],tdata[7:0]} \
] [get_bd_cells axis_subset_converter_0]
create_bd_cell -type ip -vlnv starrynightzyq.com:hls:draw_line_hls:1.2 draw_line_hls_0

# ---- hierarchy /ov_cmos/cmos2axis ----
current_bd_instance /ov_cmos/cmos2axis
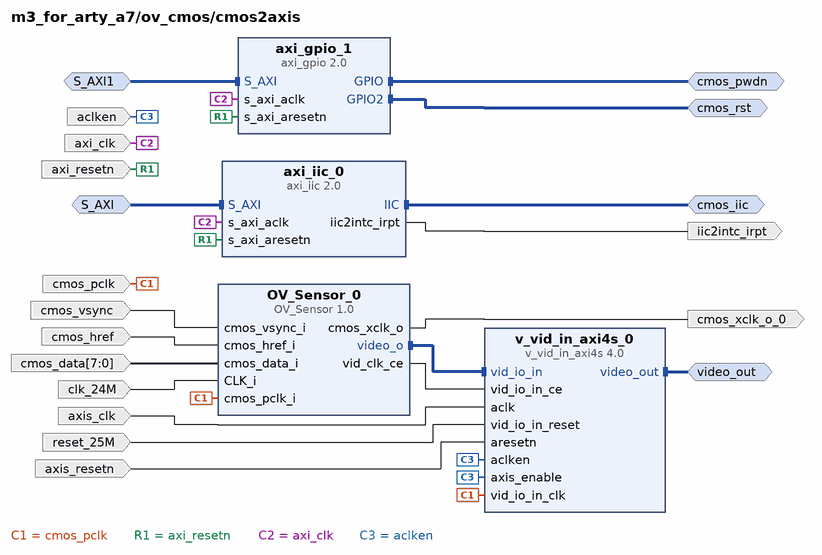
[diagram p8: block diagram inside /ov_cmos/cmos2axis]
create_bd_intf_pin -mode Master -vlnv xilinx.com:interface:axis_rtl:1.0 video_out
create_bd_intf_pin -mode Master -vlnv xilinx.com:interface:iic_rtl:1.0 cmos_iic
create_bd_intf_pin -mode Master -vlnv xilinx.com:interface:gpio_rtl:1.0 cmos_pwdn
create_bd_intf_pin -mode Master -vlnv xilinx.com:interface:gpio_rtl:1.0 cmos_rst
create_bd_intf_pin -mode Slave -vlnv xilinx.com:interface:aximm_rtl:1.0 S_AXI
create_bd_intf_pin -mode Slave -vlnv xilinx.com:interface:aximm_rtl:1.0 S_AXI1
create_bd_pin -dir I -type clk cmos_pclk
create_bd_pin -dir I cmos_href
create_bd_pin -dir I cmos_vsync
create_bd_pin -dir I -from 7 -to 0 cmos_data
create_bd_pin -dir O cmos_xclk_o_0
create_bd_pin -dir I -type clk axis_clk
create_bd_pin -dir I -type clk clk_24M
create_bd_pin -dir I -type rst reset_25M
create_bd_pin -dir I -type rst axis_resetn
create_bd_pin -dir I -type rst axi_resetn
create_bd_pin -dir I -type clk axi_clk
create_bd_pin -dir O -type intr iic2intc_irpt
create_bd_pin -dir I -type ce aclken

create_bd_cell -type ip -vlnv xilinx.com:ip:v_vid_in_axi4s:4.0 v_vid_in_axi4s_0
set_property -dict {CONFIG.C_HAS_ASYNC_CLK 1} [get_bd_cells v_vid_in_axi4s_0]
create_bd_cell -type ip -vlnv xilinx.com:ip:axi_gpio:2.0 axi_gpio_1
set_property -dict [list \
  CONFIG.C_GPIO_WIDTH 1 \
  CONFIG.C_GPIO2_WIDTH 1 \
  CONFIG.C_IS_DUAL 1 \
  CONFIG.C_DOUT_DEFAULT_2 0xFFFFFFFF \
  CONFIG.C_ALL_INPUTS_2 0 \
  CONFIG.C_INTERRUPT_PRESENT 1 \
  CONFIG.USE_BOARD_FLOW true \
  CONFIG.GPIO_BOARD_INTERFACE Custom \
  CONFIG.GPIO2_BOARD_INTERFACE Custom \
  CONFIG.C_ALL_OUTPUTS 1 \
  CONFIG.C_ALL_OUTPUTS_2 1 \
] [get_bd_cells axi_gpio_1]
create_bd_cell -type ip -vlnv xilinx.com:ip:axi_iic:2.0 axi_iic_0
set_property -dict {CONFIG.USE_BOARD_FLOW true CONFIG.IIC_BOARD_INTERFACE Custom} [get_bd_cells axi_iic_0]
create_bd_cell -type ip -vlnv starrynightzyq.com:video:OV_Sensor:1.0 OV_Sensor_0
set_property -dict {CONFIG.RBG_CHANGE false} [get_bd_cells OV_Sensor_0]

# ---- hierarchy /ov_cmos/display ----
current_bd_instance /ov_cmos/display
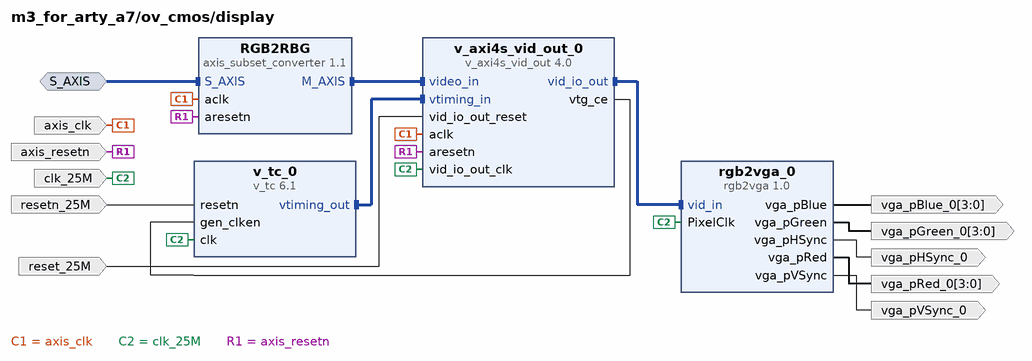
[diagram p9: block diagram inside /ov_cmos/display]
create_bd_intf_pin -mode Slave -vlnv xilinx.com:interface:axis_rtl:1.0 S_AXIS
create_bd_pin -dir O -from 3 -to 0 vga_pGreen_0
create_bd_pin -dir O -from 3 -to 0 vga_pBlue_0
create_bd_pin -dir O vga_pHSync_0
create_bd_pin -dir O -from 3 -to 0 vga_pRed_0
create_bd_pin -dir O vga_pVSync_0
create_bd_pin -dir I -type clk axis_clk
create_bd_pin -dir I -type clk clk_25M
create_bd_pin -dir I -type rst reset_25M
create_bd_pin -dir I -type rst resetn_25M
create_bd_pin -dir I -type rst axis_resetn

create_bd_cell -type ip -vlnv xilinx.com:ip:v_axi4s_vid_out:4.0 v_axi4s_vid_out_0
set_property -dict {CONFIG.C_HAS_ASYNC_CLK 1 CONFIG.C_ADDR_WIDTH 11 CONFIG.C_VTG_MASTER_SLAVE 0} [get_bd_cells v_axi4s_vid_out_0]
create_bd_cell -type ip -vlnv xilinx.com:ip:v_tc:6.1 v_tc_0
set_property -dict {CONFIG.HAS_AXI4_LITE false CONFIG.VIDEO_MODE 640x480p CONFIG.enable_detection false} [get_bd_cells v_tc_0]
create_bd_cell -type ip -vlnv digilentinc.com:ip:rgb2vga:1.0 rgb2vga_0
set_property -dict {CONFIG.kBlueDepth 4 CONFIG.kGreenDepth 4 CONFIG.kRedDepth 4} [get_bd_cells rgb2vga_0]
create_bd_cell -type ip -vlnv xilinx.com:ip:axis_subset_converter:1.1 RGB2RBG
set_property -dict {CONFIG.TDATA_REMAP {tdata[23:16],tdata[7:0],tdata[15:8]}} [get_bd_cells RGB2RBG]

# ---- hierarchy /ov_cmos/clk_and_reset ----
current_bd_instance /ov_cmos/clk_and_reset
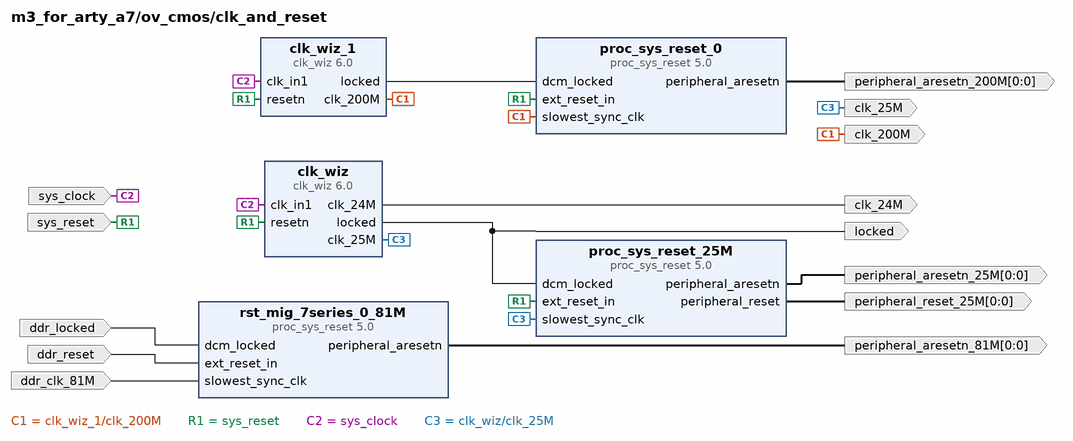
[diagram p10: block diagram inside /ov_cmos/clk_and_reset]
create_bd_pin -dir O -type clk clk_200M
create_bd_pin -dir I -type rst sys_reset
create_bd_pin -dir I -type clk sys_clock
create_bd_pin -dir O -type clk clk_24M
create_bd_pin -dir O -type clk clk_25M
create_bd_pin -dir I ddr_locked
create_bd_pin -dir O -from 0 -to 0 -type rst peripheral_aresetn_81M
create_bd_pin -dir I -type rst ddr_reset
create_bd_pin -dir I -type clk ddr_clk_81M
create_bd_pin -dir O -from 0 -to 0 -type rst peripheral_aresetn_25M
create_bd_pin -dir O -from 0 -to 0 -type rst peripheral_reset_25M
create_bd_pin -dir O -type ce locked
create_bd_pin -dir O -from 0 -to 0 peripheral_aresetn_200M

create_bd_cell -type ip -vlnv xilinx.com:ip:clk_wiz:6.0 clk_wiz
set_property -dict [list \
  CONFIG.CLKOUT2_USED true \
  CONFIG.CLKOUT3_USED false \
  CONFIG.NUM_OUT_CLKS 2 \
  CONFIG.CLK_OUT1_PORT clk_25M \
  CONFIG.CLK_OUT2_PORT clk_24M \
  CONFIG.CLK_OUT3_PORT clk_100M \
  CONFIG.CLKOUT1_REQUESTED_OUT_FREQ 25.000 \
  CONFIG.CLKOUT2_REQUESTED_OUT_FREQ 24.000 \
  CONFIG.PRIM_SOURCE Single_ended_clock_capable_pin \
  CONFIG.RESET_PORT resetn \
  CONFIG.MMCM_DIVCLK_DIVIDE 1 \
  CONFIG.MMCM_CLKFBOUT_MULT_F 6.000 \
  CONFIG.MMCM_CLKIN1_PERIOD 10.0 \
  CONFIG.MMCM_CLKIN2_PERIOD 10.0 \
  CONFIG.MMCM_CLKOUT0_DIVIDE_F 24.000 \
  CONFIG.MMCM_CLKOUT1_DIVIDE 25 \
  CONFIG.MMCM_CLKOUT2_DIVIDE 1 \
  CONFIG.RESET_TYPE ACTIVE_LOW \
  CONFIG.USE_BOARD_FLOW true \
  CONFIG.CLK_IN1_BOARD_INTERFACE Custom \
  CONFIG.RESET_BOARD_INTERFACE reset \
  CONFIG.CLKOUT1_JITTER 200.470 \
  CONFIG.CLKOUT1_PHASE_ERROR 132.063 \
  CONFIG.CLKOUT2_JITTER 202.114 \
  CONFIG.CLKOUT2_PHASE_ERROR 132.063 \
  CONFIG.CLKOUT3_JITTER 151.366 \
  CONFIG.CLKOUT3_PHASE_ERROR 132.063 \
] [get_bd_cells clk_wiz]
create_bd_cell -type ip -vlnv xilinx.com:ip:clk_wiz:6.0 clk_wiz_1
set_property -dict [list \
  CONFIG.CLK_OUT1_PORT clk_200M \
  CONFIG.CLKOUT1_REQUESTED_OUT_FREQ 200.000 \
  CONFIG.PRIM_SOURCE Single_ended_clock_capable_pin \
  CONFIG.RESET_PORT resetn \
  CONFIG.MMCM_DIVCLK_DIVIDE 1 \
  CONFIG.MMCM_CLKOUT0_DIVIDE_F 5.000 \
  CONFIG.RESET_TYPE ACTIVE_LOW \
  CONFIG.CLKOUT1_JITTER 114.829 \
] [get_bd_cells clk_wiz_1]
create_bd_cell -type ip -vlnv xilinx.com:ip:proc_sys_reset:5.0 rst_mig_7series_0_81M
create_bd_cell -type ip -vlnv xilinx.com:ip:proc_sys_reset:5.0 proc_sys_reset_25M
set_property -dict {CONFIG.USE_BOARD_FLOW true CONFIG.RESET_BOARD_INTERFACE reset} [get_bd_cells proc_sys_reset_25M]
create_bd_cell -type ip -vlnv xilinx.com:ip:proc_sys_reset:5.0 proc_sys_reset_0

# ---- hierarchy /LCD ----
current_bd_instance /LCD
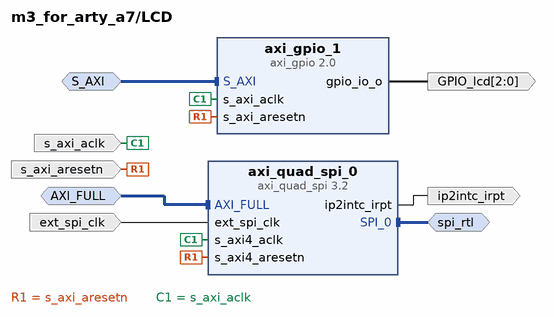
[diagram p11: block diagram inside /LCD]
create_bd_intf_pin -mode Slave -vlnv xilinx.com:interface:aximm_rtl:1.0 S_AXI
create_bd_intf_pin -mode Slave -vlnv xilinx.com:interface:aximm_rtl:1.0 AXI_FULL
create_bd_intf_pin -mode Master -vlnv xilinx.com:interface:spi_rtl:1.0 spi_rtl
create_bd_pin -dir O -from 2 -to 0 GPIO_lcd
create_bd_pin -dir I -type rst s_axi_aresetn
create_bd_pin -dir I -type clk s_axi_aclk
create_bd_pin -dir O -type intr ip2intc_irpt
create_bd_pin -dir I -type clk ext_spi_clk

create_bd_cell -type ip -vlnv xilinx.com:ip:axi_gpio:2.0 axi_gpio_1
set_property -dict {CONFIG.C_GPIO_WIDTH 3 CONFIG.C_ALL_OUTPUTS 1} [get_bd_cells axi_gpio_1]
create_bd_cell -type ip -vlnv xilinx.com:ip:axi_quad_spi:3.2 axi_quad_spi_0
set_property -dict [list \
  CONFIG.C_USE_STARTUP 0 \
  CONFIG.C_NUM_SS_BITS 2 \
  CONFIG.C_SCK_RATIO 16 \
  CONFIG.C_XIP_MODE 0 \
  CONFIG.C_TYPE_OF_AXI4_INTERFACE 1 \
  CONFIG.Master_mode 1 \
  CONFIG.USE_BOARD_FLOW true \
  CONFIG.QSPI_BOARD_INTERFACE Custom \
] [get_bd_cells axi_quad_spi_0]

# ---- connections ----

current_bd_instance /Clocks_and_Resets
connect_bd_net -net dcm_locked_1 [get_bd_pins clk_wiz_0/locked] \
  [get_bd_pins proc_sys_reset_DAPLink/dcm_locked] [get_bd_pins proc_sys_reset_base/dcm_locked]
connect_bd_net [get_bd_pins aux_reset_in] [get_bd_pins proc_sys_reset_DAPLink/aux_reset_in]
connect_bd_net [get_bd_pins clk_wiz_0/clk_out1] \
  [get_bd_pins clk_cpu] [get_bd_pins proc_sys_reset_DAPLink/slowest_sync_clk] \
  [get_bd_pins proc_sys_reset_base/slowest_sync_clk]
connect_bd_net [get_bd_pins sys_clock] [get_bd_pins clk_wiz_0/clk_in1]
connect_bd_net [get_bd_pins proc_sys_reset_DAPLink/peripheral_aresetn] [get_bd_pins i_peripheral_aresetn1/Op2]
connect_bd_net [get_bd_pins proc_sys_reset_DAPLink/interconnect_aresetn] [get_bd_pins i_interconnect_aresetn/Op2]
connect_bd_net [get_bd_pins proc_sys_reset_base/peripheral_aresetn] [get_bd_pins i_peripheral_aresetn1/Op1]
connect_bd_net [get_bd_pins proc_sys_reset_base/interconnect_aresetn] [get_bd_pins i_interconnect_aresetn/Op1]
connect_bd_net [get_bd_pins i_peripheral_aresetn1/Res] [get_bd_pins peripheral_aresetn]
connect_bd_net [get_bd_pins i_interconnect_aresetn/Res] [get_bd_pins interconnect_aresetn]
connect_bd_net [get_bd_pins proc_sys_reset_base/mb_reset] [get_bd_pins i_inv_dbgresetn/Op1] [get_bd_pins i_sysresetn_or/Op1]
connect_bd_net [get_bd_pins proc_sys_reset_DAPLink/mb_reset] [get_bd_pins i_sysresetn_or/Op2]
connect_bd_net [get_bd_pins i_inv_sysresetn1/Res] [get_bd_pins sysresetn]
connect_bd_net [get_bd_pins i_inv_dbgresetn/Res] [get_bd_pins dbgresetn]
connect_bd_net [get_bd_pins i_sysresetn_or/Res] [get_bd_pins i_inv_sysresetn1/Op1]
connect_bd_net -net xlconstant_0_dout [get_bd_pins xlconstant_1/dout] [get_bd_pins proc_sys_reset_DAPLink/ext_reset_in]
connect_bd_net [get_bd_pins clk_wiz_0/clk_out2] [get_bd_pins clk_qspi]
connect_bd_net [get_bd_pins sysresetreq] [get_bd_pins proc_sys_reset_DAPLink/mb_debug_sys_rst]
connect_bd_net [get_bd_pins sys_reset_n] [get_bd_pins proc_sys_reset_base/ext_reset_in]
connect_bd_net [get_bd_pins clk_wiz_0/clk_100M] [get_bd_pins clk_100M]

current_bd_instance /ov_cmos
connect_bd_intf_net [get_bd_intf_pins mig_7series_0/S_AXI] [get_bd_intf_pins axi_smc/M00_AXI]
connect_bd_intf_net [get_bd_intf_pins axi_vdma_0/M_AXI_S2MM] [get_bd_intf_pins axi_smc/S01_AXI]
connect_bd_intf_net [get_bd_intf_pins axi_vdma_0/M_AXI_S2MM] [get_bd_intf_pins system_ila_0/SLOT_0_AXI]
connect_bd_intf_net [get_bd_intf_pins axi_vdma_0/M_AXI_MM2S] [get_bd_intf_pins axi_smc/S00_AXI]
connect_bd_intf_net [get_bd_intf_pins axi_vdma_0/M_AXI_MM2S] [get_bd_intf_pins system_ila_0/SLOT_1_AXI]
connect_bd_intf_net [get_bd_intf_pins axi_vdma_0/S_AXI_LITE] [get_bd_intf_pins axi_interconnect_1/M00_AXI]
connect_bd_intf_net [get_bd_intf_pins axi_smc/S02_AXI] [get_bd_intf_pins axi_interconnect_1/M03_AXI]
connect_bd_intf_net [get_bd_intf_pins Image_Process/S00_AXI] [get_bd_intf_pins axi_interconnect_1/M04_AXI]
connect_bd_intf_net [get_bd_intf_pins axi_vdma_0/S_AXIS_S2MM] [get_bd_intf_pins cmos2axis/video_out]
connect_bd_intf_net [get_bd_intf_pins axi_vdma_0/S_AXIS_S2MM] [get_bd_intf_pins system_ila_0/SLOT_2_AXIS]
connect_bd_intf_net [get_bd_intf_pins axi_interconnect_1/M01_AXI] [get_bd_intf_pins cmos2axis/S_AXI]
connect_bd_intf_net [get_bd_intf_pins axi_interconnect_1/M02_AXI] [get_bd_intf_pins cmos2axis/S_AXI1]
connect_bd_intf_net [get_bd_intf_pins axi_vdma_0/M_AXIS_MM2S] [get_bd_intf_pins axis_switch_0/S00_AXIS]
connect_bd_intf_net [get_bd_intf_pins axi_vdma_0/M_AXIS_MM2S] [get_bd_intf_pins system_ila_0/SLOT_3_AXIS]
connect_bd_intf_net [get_bd_intf_pins axis_switch_0/M00_AXIS] [get_bd_intf_pins axis_switch_1/S00_AXIS]
connect_bd_intf_net [get_bd_intf_pins axis_switch_1/M00_AXIS] [get_bd_intf_pins display/S_AXIS]
connect_bd_intf_net [get_bd_intf_pins axis_switch_1/M00_AXIS] [get_bd_intf_pins system_ila_0/SLOT_4_AXIS]
connect_bd_intf_net [get_bd_intf_pins axis_switch_0/M01_AXIS] [get_bd_intf_pins Image_Process/S_AXIS]
connect_bd_intf_net [get_bd_intf_pins axis_switch_0/M01_AXIS] [get_bd_intf_pins system_ila_0/SLOT_5_AXIS]
connect_bd_intf_net [get_bd_intf_pins axi_interconnect_1/M05_AXI] [get_bd_intf_pins axis_switch_0/S_AXI_CTRL]
connect_bd_intf_net [get_bd_intf_pins axi_interconnect_1/M06_AXI] [get_bd_intf_pins axis_switch_1/S_AXI_CTRL]
connect_bd_intf_net [get_bd_intf_pins axis_switch_1/S01_AXIS] [get_bd_intf_pins Image_Process/M_AXIS]
connect_bd_intf_net [get_bd_intf_pins axis_switch_1/S01_AXIS] [get_bd_intf_pins system_ila_0/SLOT_6_AXIS]
connect_bd_intf_net [get_bd_intf_pins DDR2_0] [get_bd_intf_pins mig_7series_0/DDR2]
connect_bd_intf_net [get_bd_intf_pins cmos_iic] [get_bd_intf_pins cmos2axis/cmos_iic]
connect_bd_intf_net [get_bd_intf_pins cmos_rst] [get_bd_intf_pins cmos2axis/cmos_rst]
connect_bd_intf_net [get_bd_intf_pins cmos_pwdn] [get_bd_intf_pins cmos2axis/cmos_pwdn]
connect_bd_intf_net [get_bd_intf_pins S00_AXI] [get_bd_intf_pins axi_interconnect_1/S00_AXI]
connect_bd_net [get_bd_pins s_axi_lite_aclk] \
  [get_bd_pins axi_vdma_0/s_axi_lite_aclk] [get_bd_pins axis_switch_0/s_axi_ctrl_aclk] \
  [get_bd_pins axis_switch_1/s_axi_ctrl_aclk] [get_bd_pins Image_Process/axi_clk] [get_bd_pins axi_interconnect_1/S00_ACLK] \
  [get_bd_pins axi_interconnect_1/M04_ACLK] [get_bd_pins axi_interconnect_1/M00_ACLK] \
  [get_bd_pins axi_interconnect_1/M01_ACLK] [get_bd_pins axi_interconnect_1/M02_ACLK] [get_bd_pins axi_interconnect_1/ACLK] \
  [get_bd_pins axi_interconnect_1/M05_ACLK] [get_bd_pins cmos2axis/axi_clk] [get_bd_pins axi_interconnect_1/M06_ACLK]
connect_bd_net [get_bd_pins axi_resetn] \
  [get_bd_pins axi_vdma_0/axi_resetn] [get_bd_pins axis_switch_0/s_axi_ctrl_aresetn] \
  [get_bd_pins axis_switch_1/s_axi_ctrl_aresetn] [get_bd_pins Image_Process/axi_resetn] [get_bd_pins cmos2axis/axi_resetn]
connect_bd_net [get_bd_pins mig_7series_0/ui_clk] \
  [get_bd_pins axi_smc/aclk] [get_bd_pins axi_interconnect_1/M03_ACLK] [get_bd_pins clk_and_reset/ddr_clk_81M]
connect_bd_net -net aresetn_1 [get_bd_pins clk_and_reset/peripheral_aresetn_81M] [get_bd_pins mig_7series_0/aresetn] [get_bd_pins axi_smc/aresetn]
connect_bd_net -net reset_0_1 [get_bd_pins reset] [get_bd_pins mig_7series_0/sys_rst] [get_bd_pins clk_and_reset/sys_reset]
connect_bd_net [get_bd_pins mig_7series_0/mmcm_locked] [get_bd_pins clk_and_reset/ddr_locked]
connect_bd_net -net clk_wiz_clk_25M [get_bd_pins clk_and_reset/clk_25M] [get_bd_pins display/clk_25M]
connect_bd_net -net proc_sys_reset_0_peripheral_reset [get_bd_pins clk_and_reset/peripheral_reset_25M] \
  [get_bd_pins cmos2axis/reset_25M] [get_bd_pins display/reset_25M]
connect_bd_net -net M04_ARESETN_1 [get_bd_pins interconnect_aresetn] \
  [get_bd_pins axi_interconnect_1/M04_ARESETN] [get_bd_pins axi_interconnect_1/S00_ARESETN] \
  [get_bd_pins axi_interconnect_1/M00_ARESETN] [get_bd_pins axi_interconnect_1/M01_ARESETN] \
  [get_bd_pins axi_interconnect_1/M02_ARESETN] [get_bd_pins axi_interconnect_1/M03_ARESETN] \
  [get_bd_pins axi_interconnect_1/ARESETN] [get_bd_pins axi_interconnect_1/M05_ARESETN] \
  [get_bd_pins axi_interconnect_1/M06_ARESETN]
connect_bd_net -net Image_Process_char_valid_c_o_0 [get_bd_pins Image_Process/char_valid_co] [get_bd_pins char_valid_c_o_0]
connect_bd_net [get_bd_pins cmos_pclk] [get_bd_pins cmos2axis/cmos_pclk]
connect_bd_net [get_bd_pins cmos_href] [get_bd_pins cmos2axis/cmos_href]
connect_bd_net [get_bd_pins cmos_vsync] [get_bd_pins cmos2axis/cmos_vsync]
connect_bd_net [get_bd_pins cmos_data] [get_bd_pins cmos2axis/cmos_data]
connect_bd_net [get_bd_pins cmos2axis/cmos_xclk_o_0] [get_bd_pins cmos_xclk_o_0]
connect_bd_net [get_bd_pins cmos2axis/iic2intc_irpt] [get_bd_pins iic2intc_irpt]
connect_bd_net [get_bd_pins display/vga_pGreen_0] [get_bd_pins vga_pGreen_0]
connect_bd_net [get_bd_pins display/vga_pBlue_0] [get_bd_pins vga_pBlue_0]
connect_bd_net [get_bd_pins display/vga_pHSync_0] [get_bd_pins vga_pHSync_0]
connect_bd_net [get_bd_pins display/vga_pRed_0] [get_bd_pins vga_pRed_0]
connect_bd_net [get_bd_pins display/vga_pVSync_0] [get_bd_pins vga_pVSync_0]
connect_bd_net [get_bd_pins clk_and_reset/clk_200M] \
  [get_bd_pins mig_7series_0/sys_clk_i] [get_bd_pins axi_vdma_0/m_axis_mm2s_aclk] [get_bd_pins axis_switch_0/aclk] \
  [get_bd_pins axis_switch_1/aclk] [get_bd_pins axi_vdma_0/s_axis_s2mm_aclk] [get_bd_pins Image_Process/axis_clk] \
  [get_bd_pins display/axis_clk] [get_bd_pins cmos2axis/axis_clk] [get_bd_pins axi_vdma_0/m_axi_mm2s_aclk] \
  [get_bd_pins axi_vdma_0/m_axi_s2mm_aclk] [get_bd_pins axi_smc/aclk1] [get_bd_pins system_ila_0/clk]
connect_bd_net [get_bd_pins sys_clock] [get_bd_pins clk_and_reset/sys_clock]
connect_bd_net -net CLK_i_1 [get_bd_pins clk_and_reset/clk_24M] [get_bd_pins cmos2axis/clk_24M]
connect_bd_net [get_bd_pins mig_7series_0/ui_clk_sync_rst] [get_bd_pins clk_and_reset/ddr_reset]
connect_bd_net -net resetn_1 [get_bd_pins clk_and_reset/peripheral_aresetn_25M] [get_bd_pins display/resetn_25M]
connect_bd_net [get_bd_pins clk_and_reset/locked] [get_bd_pins cmos2axis/aclken]
connect_bd_net [get_bd_pins clk_and_reset/peripheral_aresetn_200M] \
  [get_bd_pins axis_switch_0/aresetn] [get_bd_pins axis_switch_1/aresetn] [get_bd_pins Image_Process/axis_resetn] \
  [get_bd_pins display/axis_resetn] [get_bd_pins cmos2axis/axis_resetn] [get_bd_pins system_ila_0/resetn]
connect_bd_net -net shift_0_1 [get_bd_pins shift_0] [get_bd_pins Image_Process/shift_0]

current_bd_instance /ov_cmos/Image_Process
connect_bd_intf_net [get_bd_intf_pins threshold2_0/s_axi_AXILiteS] [get_bd_intf_pins axi_interconnect_0/M00_AXI]
connect_bd_intf_net [get_bd_intf_pins mask_0/s_axi_AXILiteS] [get_bd_intf_pins axi_interconnect_0/M01_AXI]
connect_bd_intf_net [get_bd_intf_pins mask_0/output_r] [get_bd_intf_pins projection_mul_hls_0/input_r]
connect_bd_intf_net [get_bd_intf_pins projection_mul_hls_0/s_axi_AXILiteS] [get_bd_intf_pins axi_interconnect_0/M03_AXI]
connect_bd_intf_net [get_bd_intf_pins projection_mul_hls_0/output_r] [get_bd_intf_pins axis_broadcaster_0/S_AXIS]
connect_bd_intf_net [get_bd_intf_pins axis_broadcaster_0/M01_AXIS] [get_bd_intf_pins resize/input_r]
connect_bd_intf_net [get_bd_intf_pins axi_interconnect_0/M06_AXI] [get_bd_intf_pins contrast/s_axi_AXILiteS]
connect_bd_intf_net [get_bd_intf_pins resize/M_AXIS] [get_bd_intf_pins contrast/input_r]
connect_bd_intf_net [get_bd_intf_pins axi_interconnect_0/M02_AXI] [get_bd_intf_pins projection1/s_axi_AXILiteS]
connect_bd_intf_net [get_bd_intf_pins mask_0/input_r] [get_bd_intf_pins projection1/output_r]
connect_bd_intf_net [get_bd_intf_pins threshold2_0/output_r] [get_bd_intf_pins projection1/input_r]
connect_bd_intf_net [get_bd_intf_pins axis_broadcaster_0/M00_AXIS] [get_bd_intf_pins drawlines/input_r]
connect_bd_intf_net [get_bd_intf_pins axi_interconnect_0/M04_AXI] [get_bd_intf_pins drawlines/s_axi_AXILiteS]
connect_bd_intf_net [get_bd_intf_pins axi_interconnect_0/M07_AXI] [get_bd_intf_pins contrast/S_AXI]
connect_bd_intf_net [get_bd_intf_pins axi_interconnect_0/M05_AXI] [get_bd_intf_pins resize/s_axi_AXILiteS]
connect_bd_intf_net [get_bd_intf_pins gpio_ap_ctrl/S_AXI] [get_bd_intf_pins axi_interconnect_0/M08_AXI]
connect_bd_intf_net [get_bd_intf_pins S00_AXI] [get_bd_intf_pins axi_interconnect_0/S00_AXI]
connect_bd_intf_net [get_bd_intf_pins S_AXIS] [get_bd_intf_pins threshold2_0/input_r]
connect_bd_intf_net [get_bd_intf_pins M_AXIS] [get_bd_intf_pins drawlines/M_AXIS]
connect_bd_net -net axi_resetn_1 [get_bd_pins axis_resetn] \
  [get_bd_pins axis_broadcaster_0/aresetn] [get_bd_pins mask_0/ap_rst_n] [get_bd_pins threshold2_0/ap_rst_n] \
  [get_bd_pins projection_mul_hls_0/ap_rst_n] [get_bd_pins gpio_ap_ctrl/s_axi_aresetn] \
  [get_bd_pins axi_interconnect_0/M00_ARESETN] [get_bd_pins axi_interconnect_0/M01_ARESETN] \
  [get_bd_pins axi_interconnect_0/M02_ARESETN] [get_bd_pins axi_interconnect_0/M03_ARESETN] \
  [get_bd_pins axi_interconnect_0/M04_ARESETN] [get_bd_pins axi_interconnect_0/M05_ARESETN] \
  [get_bd_pins axi_interconnect_0/M06_ARESETN] [get_bd_pins axi_interconnect_0/M07_ARESETN] [get_bd_pins resize/aresetn] \
  [get_bd_pins contrast/ap_rst_n] [get_bd_pins drawlines/ap_rst_n] [get_bd_pins projection1/ap_rst_n] \
  [get_bd_pins axi_interconnect_0/M08_ARESETN]
connect_bd_net -net clk_200M_1 [get_bd_pins axis_clk] \
  [get_bd_pins axis_broadcaster_0/aclk] [get_bd_pins mask_0/ap_clk] [get_bd_pins threshold2_0/ap_clk] \
  [get_bd_pins projection_mul_hls_0/ap_clk] [get_bd_pins gpio_ap_ctrl/s_axi_aclk] [get_bd_pins axi_interconnect_0/M00_ACLK] \
  [get_bd_pins axi_interconnect_0/M01_ACLK] [get_bd_pins axi_interconnect_0/M02_ACLK] \
  [get_bd_pins axi_interconnect_0/M03_ACLK] [get_bd_pins axi_interconnect_0/M04_ACLK] \
  [get_bd_pins axi_interconnect_0/M05_ACLK] [get_bd_pins axi_interconnect_0/M06_ACLK] \
  [get_bd_pins axi_interconnect_0/M07_ACLK] [get_bd_pins resize/aclk] [get_bd_pins contrast/ap_clk] \
  [get_bd_pins drawlines/ap_clk] [get_bd_pins projection1/ap_clk] [get_bd_pins axi_interconnect_0/M08_ACLK]
connect_bd_net -net ACLK_1 [get_bd_pins axi_clk] [get_bd_pins axi_interconnect_0/ACLK] [get_bd_pins axi_interconnect_0/S00_ACLK]
connect_bd_net -net ARESETN_1 [get_bd_pins axi_resetn] [get_bd_pins axi_interconnect_0/ARESETN] [get_bd_pins axi_interconnect_0/S00_ARESETN]
connect_bd_net [get_bd_pins xlconstant_0/dout] \
  [get_bd_pins mask_0/bound_x_max_ap_vld] [get_bd_pins mask_0/bound_y_min_ap_vld] [get_bd_pins mask_0/bound_y_max_ap_vld] \
  [get_bd_pins mask_0/bound_x_min_ap_vld]
connect_bd_net -net bound_fsm_0_bound_y_min_o [get_bd_pins projection1/bound_y_min_o] \
  [get_bd_pins mask_0/bound_y_min] [get_bd_pins resize/bound_y_min_i] [get_bd_pins drawlines/bound_y_min]
connect_bd_net -net bound_fsm_0_bound_y_max_o [get_bd_pins projection1/bound_y_max_o] \
  [get_bd_pins mask_0/bound_y_max] [get_bd_pins resize/bound_y_max_i] [get_bd_pins drawlines/bound_y_max]
connect_bd_net [get_bd_pins projection_mul_hls_0/bound_min_address0] [get_bd_pins resize/addra] [get_bd_pins drawlines/addra]
connect_bd_net [get_bd_pins projection_mul_hls_0/bound_max_address0] [get_bd_pins resize/addra1] [get_bd_pins drawlines/addra1]
connect_bd_net [get_bd_pins projection_mul_hls_0/bound_min_d0] [get_bd_pins resize/dina1] [get_bd_pins drawlines/dina1]
connect_bd_net [get_bd_pins projection_mul_hls_0/bound_max_d0] [get_bd_pins resize/dina] [get_bd_pins drawlines/dina]
connect_bd_net [get_bd_pins projection_mul_hls_0/bound_min_ce0] [get_bd_pins resize/ena1] [get_bd_pins drawlines/ena1]
connect_bd_net [get_bd_pins projection_mul_hls_0/bound_min_we0] [get_bd_pins resize/wea] [get_bd_pins drawlines/wea]
connect_bd_net [get_bd_pins projection_mul_hls_0/bound_max_ce0] [get_bd_pins resize/ena] [get_bd_pins drawlines/ena]
connect_bd_net [get_bd_pins projection_mul_hls_0/bound_max_we0] [get_bd_pins resize/wea1] [get_bd_pins drawlines/wea1]
connect_bd_net -net resize_ctrl_0_bound_x_min_addr [get_bd_pins resize/bound_x_min_addr] [get_bd_pins contrast/char_addr]
connect_bd_net [get_bd_pins xlconstant_1/dout] [get_bd_pins projection_mul_hls_0/bound_min_q0] [get_bd_pins projection_mul_hls_0/bound_max_q0]
connect_bd_net [get_bd_pins projection1/bound_x_min_o] [get_bd_pins mask_0/bound_x_min]
connect_bd_net [get_bd_pins projection1/bound_x_max_o] [get_bd_pins mask_0/bound_x_max]
connect_bd_net [get_bd_pins contrast/char_valid_c_o_0] [get_bd_pins char_valid_co]
connect_bd_net -net axi_gpio_0_gpio_io_o [get_bd_pins gpio_ap_ctrl/gpio_io_o] [get_bd_pins resize/ap_start]
# net resize_output_r_we0 has one end: 
# net resize_output_r_address0 has one end: 
# net resize_output_r_d0 has one end: 
# net resize_doutb has one end: 
# net resize_input_r_address0 has one end: 
# net contrast_char_index_c has one end: 
# net contrast_char_index has one end: 
# net contrast_interrupt has one end: 
# net contrast_char_valid_c has one end: 
# net contrast_char_diff has one end: 
connect_bd_net -net shift_0_1 [get_bd_pins shift_0] [get_bd_pins contrast/shift_0]
